# Altium project MCU_starter_25.PrjPcb
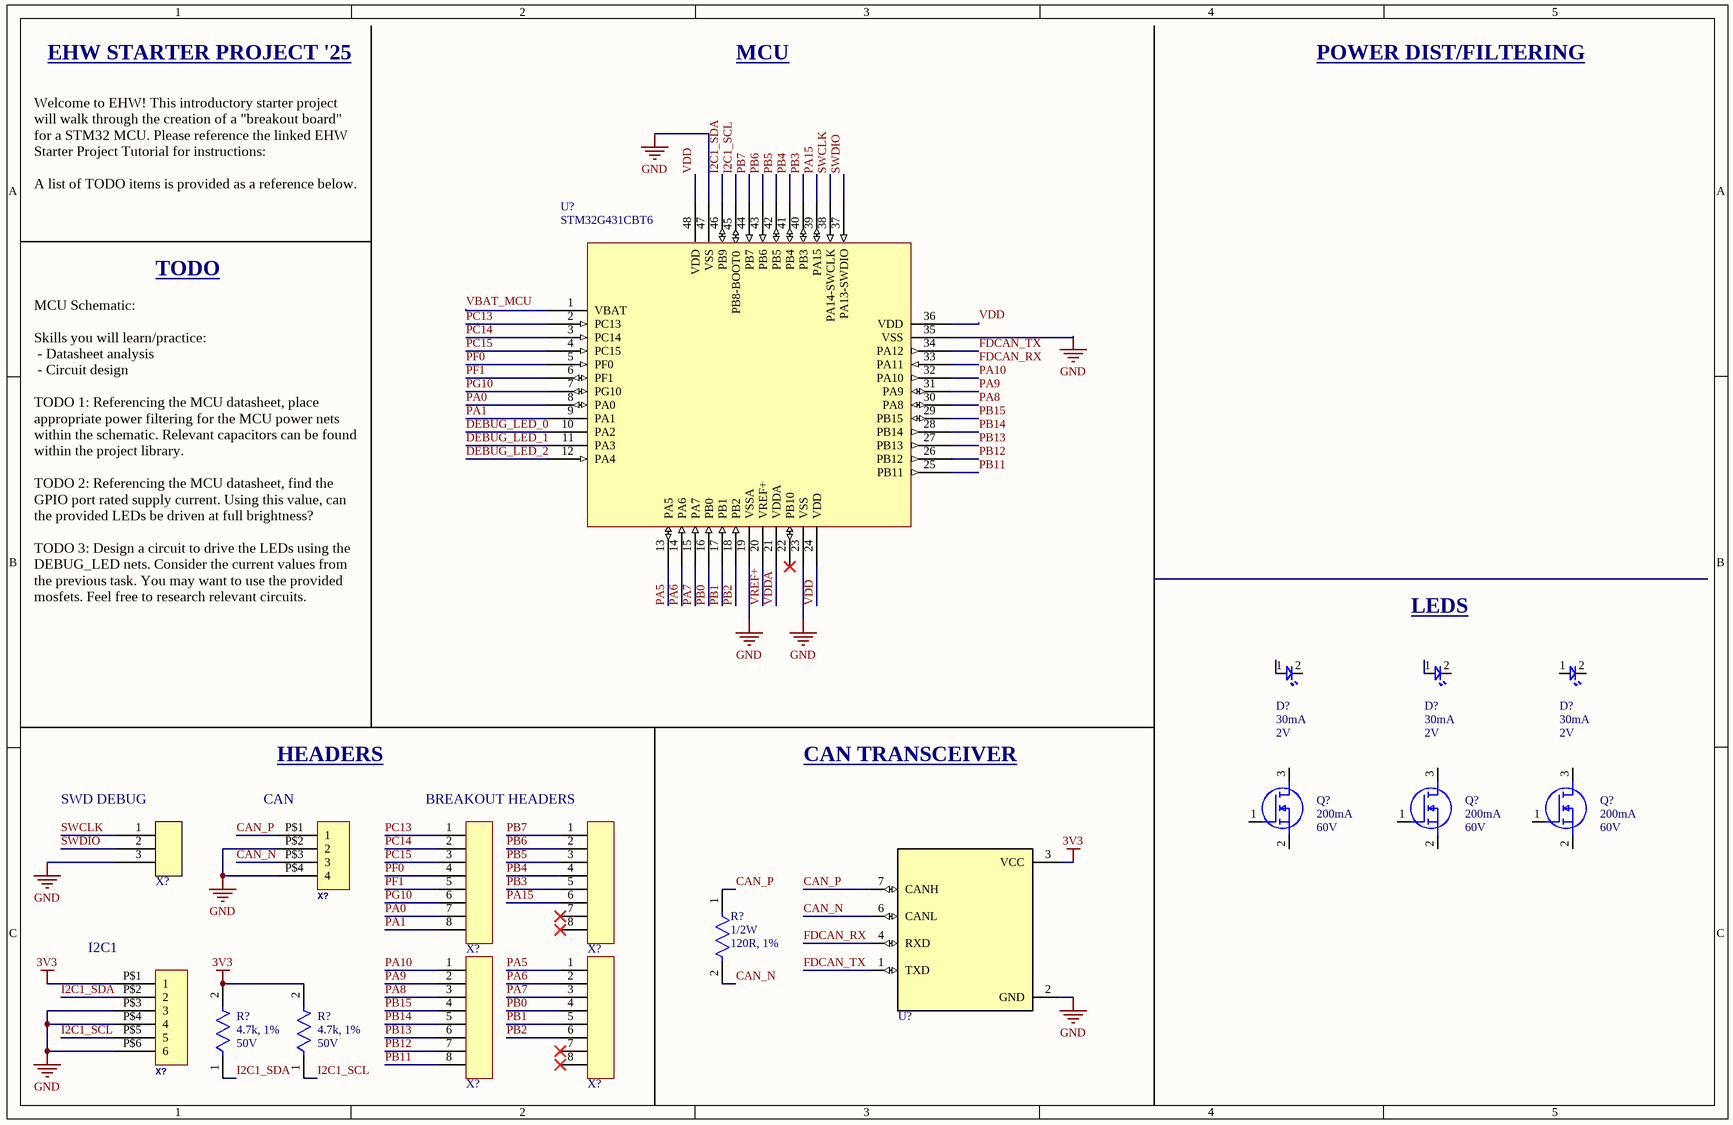
[diagram p0: MCU.SchDoc]
2 sheets, 32 parts. Net scope: global (net labels, ports and power ports of the same name join across sheets).
Sheets:
  MCU.SchDoc
  Power.SchDoc

## Sheet MCU.SchDoc
size 323 x 209 mm; SheetNumber: 1; SheetTotal: 2

### Parts
(Parts that share a designator on the sheet are numbered #1, #2 ... from top to bottom, then left to right.)
D?#1  Current Rating: 30mA  Vf: 2V  [LED0603-R-RD]  (hidden comment: BL-HKC36G-AV-TRB)
D?#2  Current Rating: 30mA  Vf: 2V  [LED0603-R-RD]  (hidden comment: BL-HKC36G-AV-TRB)
D?#3  Current Rating: 30mA  Vf: 2V  [LED0603-R-RD]  (hidden comment: BL-HKC36G-AV-TRB)
Q?#1  Id-Continuous: 200mA  VDS-Max: 60V  [NMOS-SOT23-3]  (hidden comment: T2N7002AK,LM)
Q?#2  Id-Continuous: 200mA  VDS-Max: 60V  [NMOS-SOT23-3]  (hidden comment: T2N7002AK,LM)
Q?#3  Id-Continuous: 200mA  VDS-Max: 60V  [NMOS-SOT23-3]  (hidden comment: T2N7002AK,LM)
R?#1  Power: 1/2W  Resistance: 120R, 1%  [RESC3126X60X50LL10T20]  (hidden comment: RC1210FR-07120RL)
R?#2  Voltage Rating: 50V  Resistance: 4.7k, 1%  [RESC1608X55X25LL10T15]  (hidden comment: RC0603FR-074K7L)
R?#3  Voltage Rating: 50V  Resistance: 4.7k, 1%  [RESC1608X55X25LL10T15]  (hidden comment: RC0603FR-074K7L)
U?#1  STM32G431CBT6  [Quad48]
U?#2  TCAN332GDR  [SOIC127P599X175-8N]  (value not drawn)
X?#1  61300811121  [61300811121]  (value not drawn)
X?#2  61300811121  [61300811121]  (value not drawn)
X?#3  Molex 43650-0415  [43650-0415]  (value not drawn)
X?#4  61300311121  [61300311121]  (value not drawn)
X?#5  61300811121  [61300811121]  (value not drawn)
X?#6  61300811121  [61300811121]  (value not drawn)
X?#7  Molex 43045-0612  [43045-0612]  (value not drawn)

### Nets
3V3: R?#2.2 R?#3.2 U?#2.3(VCC) X?#7.P$1(1)
GND: U?#1.19(VSSA) U?#1.23(VSS) U?#1.35(VSS) U?#1.47(VSS) U?#2.2(GND) X?#3.P$2(2) X?#3.P$4(4) X?#4.3 X?#7.P$3(3) X?#7.P$4(4) X?#7.P$6(6)
CAN_N: R?#1.2 U?#2.6(CANL) X?#3.P$3(3)
CAN_P: R?#1.1 U?#2.7(CANH) X?#3.P$1(1)
DEBUG_LED_0: U?#1.10(PA2)
DEBUG_LED_1: U?#1.11(PA3)
DEBUG_LED_2: U?#1.12(PA4)
FDCAN_RX: U?#1.33(PA11) U?#2.4(RXD)
FDCAN_TX: U?#1.34(PA12) U?#2.1(TXD)
I2C1_SCL: R?#3.1 U?#1.45(PB8-BOOT0) X?#7.P$5(5)
I2C1_SDA: R?#2.1 U?#1.46(PB9) X?#7.P$2(2)
PA0: U?#1.8(PA0) X?#1.7
PA1: U?#1.9(PA1) X?#1.8
PA5: U?#1.13(PA5) X?#6.1
PA6: U?#1.14(PA6) X?#6.2
PA7: U?#1.15(PA7) X?#6.3
PA8: U?#1.30(PA8) X?#5.3
PA9: U?#1.31(PA9) X?#5.2
PA10: U?#1.32(PA10) X?#5.1
PA15: U?#1.39(PA15) X?#2.6
PB0: U?#1.16(PB0) X?#6.4
PB1: U?#1.17(PB1) X?#6.5
PB2: U?#1.18(PB2) X?#6.6
PB3: U?#1.40(PB3) X?#2.5
PB4: U?#1.41(PB4) X?#2.4
PB5: U?#1.42(PB5) X?#2.3
PB6: U?#1.43(PB6) X?#2.2
PB7: U?#1.44(PB7) X?#2.1
PB11: U?#1.25(PB11) X?#5.8
PB12: U?#1.26(PB12) X?#5.7
PB13: U?#1.27(PB13) X?#5.6
PB14: U?#1.28(PB14) X?#5.5
PB15: U?#1.29(PB15) X?#5.4
PC13: U?#1.2(PC13) X?#1.1
PC14: U?#1.3(PC14) X?#1.2
PC15: U?#1.4(PC15) X?#1.3
PF0: U?#1.5(PF0) X?#1.4
PF1: U?#1.6(PF1) X?#1.5
PG10: U?#1.7(PG10) X?#1.6
SWCLK: U?#1.38(PA14-SWCLK) X?#4.1
SWDIO: U?#1.37(PA13-SWDIO) X?#4.2
VBAT_MCU: U?#1.1(VBAT)
VDD: U?#1.24(VDD) U?#1.36(VDD) U?#1.48(VDD)
VDDA: U?#1.21(VDDA)
VREF+: U?#1.20(VREF+)

Not connected (* = marked no-connect by the designer): D?#1 1 2; D?#2 1 2; D?#3 1 2; Q?#1 1(G) 2(S) 3(D); Q?#2 1(G) 2(S) 3(D); Q?#3 1(G) 2(S) 3(D); U?#1 22(PB10)*; X?#2 7* 8*; X?#6 7* 8*

### Notes on the sheet
- EHW STARTER PROJECT '25
- MCU
- POWER DIST/FILTERING
- Welcome to EHW! This introductory starter project will walk through the creation of a "breakout board" for a STM32 MCU. Please reference the linked EHW Starter Project Tutorial for instructions:
  A list of TODO items is provided as a reference below.
- TODO
- MCU Schematic:
  Skills you will learn/practice:
  - Datasheet analysis
  - Circuit design
  TODO 1: Referencing the MCU datasheet, place appropriate power filtering for the MCU power nets within the schematic. Relevant capacitors can be found within the project library.
  TODO 2: Referencing the MCU datasheet, find the GPIO port rated supply current. Using this value, can the provided LEDs be driven at full brightness?
  TODO 3: Design a circuit to drive the LEDs using the DEBUG_LED nets. Consider the current values from the previous task. You may want to use the provided mosfets. Feel free to research relevant circuits.
- LEDS
- (near X?#4) SWD DEBUG
- (near X?#3) CAN
- HEADERS
- (near X?#1) BREAKOUT HEADERS
- CAN TRANSCEIVER
- (near X?#7) I2C1

### Library data of the parts
D?#1-D?#3 = LED-0001: LED YELLOW CLEAR 0603 SMD
Q?#1-Q?#3 = NMOS-200MA-0001: MOSFET N-CH 60V 200MA SOT23; Manufacturer: Toshiba; FET type: N-Channel; Rds On-Max: 3.9Ohm; Vgs-Max: 20V; Assembled?: no; Manufacturer Part Number: T2N7002AK,LM; Package: SOT-23-3
R?#1 = RES-120-0001: 120 Ohms ±1% 0.5W, 1/2W Chip Resistor 1210 (3225 Metric) Moisture Resistant Thick Film; Manufacturer: Yageo; Part Number: RC1210FR-07120RL
R?#2 R?#3 = RES-4.7k-0001: Chip Resistor, 4.7 KOhm, +/- 1%, 0.1 W, -55 to 155 degC, 0603 (1608 Metric), RoHS, Tape and Reel; Manufacturer: Yageo; Power Rating: 100mW; Temperature Coefficient: 100PPM/C; Package Reference: 0603; Series: RC; Datasheet Version: Rev. 7, 05/2017; Packaging: Reel; Termination Style: SMD/SMT; Datasheet URL: http://www.yageo.com/documents/recent/PYu-RC_Group_51_RoHS_L_7.pdf; Manufacturer URL: http://www.yageo.com/; Package Description: 2-Pin Surface Mount Device, Body 1.6 x 0.8 mm; Case Code - mm: 1608; Case Code - in: 0603; Mounting Technology: SurfaceMount; Operating Temperature Range: -55Cto+155C; Tolerance: 1%; Product: ThickFilmResistorsGeneralPurpose
U?#1 = IC-STM32G431CBT6: ARM® Cortex®-M4F STM32G4 Microcontroller IC 32-Bit Single-Core 170MHz 128KB (128K x 8) FLASH 48-LQFP (7x7); Parameter 1: *
U?#2 = IC-CAN-0001: 3.3-V CAN Transceivers with CAN FD (Flexible Data Rate); MF: Texas Instruments; Purchase-URL: https://pricing.snapeda.com/search?q=TCAN332GDR&ref=eda; Package: SOIC-8 Texas Instruments; Check_prices: https://www.snapeda.com/parts/TCAN332GDR/Texas+Instruments/view-part/?ref=eda; Value: *; SnapEDA_Link: https://www.snapeda.com/parts/TCAN332GDR/Texas+Instruments/view-part/?ref=snap; MP: TCAN332GDR; Digi-Key_Part_Number: 296-48678-2-ND
X?#1 X?#2 X?#5 X?#6 = CONN-8POS-0001: CONN HEADER VERT 8POS 2.54MM; NexarPartId: 32855533; Connector Type: Male Pin; Number of Contacts: 8; Voltage Rating: 250V; Current Rating: 3A; Contact Resistance: 20mΩ; Gender: Male; Termination: Solder; Contact Material: Copper; Mount: Through Hole; Lead Pitch: 2.54mm; Number of Positions: 8; Operating Supply Voltage: 250V; Number of Pins: 8; Max Operating Temperature: 105°C; Height: 8.54mm; Pitch: 2.54mm; REACH SVHC: Unknown; Number of Rows: 1; Packaging: Bulk; Contact Plating: Gold; Contact Mating Length: 5.9944mm; Orientation: Vertical; RoHS: Compliant; Color: Black; Min Operating Temperature: -40°C
X?#3 = CONN-4POS-0001: GateName_1: G$1; SymbolName_1: HEADER_POS4; DeviceSetName: HEADER_POS4_?; DeviceName: 43650-0415; LibraryName: con-molex-micro-fit-3_0_2; Package: 43650-0415
X?#4 = CONN-3POS-0001: Connector Header Through Hole 3 position 0.100" (2.54mm); NexarPartId: 32855521; Current Rating: 3A; Voltage Rating: 250V; Number of Positions: 3; Contact Resistance: 20mΩ; Connector Type: Male Pin; Gender: Male; REACH SVHC: Unknown; Packaging: Bulk; Contact Material: Copper; Pitch: 2.54mm; Min Operating Temperature: -40°C; Number of Rows: 1; Orientation: Vertical; RoHS: Compliant; Contact Plating: Gold; Max Operating Temperature: 105°C; Mount: Through Hole; Height: 8.94mm; Operating Supply Voltage: 250V; Number of Pins: 3; Contact Mating Length: 5.9944mm; Number of Contacts: 3; Color: Black; Lead Free: Lead Free; Lead Pitch: 2.54mm; Termination: Solder
X?#7 = CONN-6POS-0001: GateName_1: G$1; SymbolName_1: HEADER_POS6; DeviceSetName: HEADER_POS6_?; DeviceName: 43045-0612; LibraryName: con-molex-micro-fit-3_0_2; Package: 43045-0612

## Sheet Power.SchDoc
size 259 x 167 mm; SheetNumber: 2; SheetTotal: 2
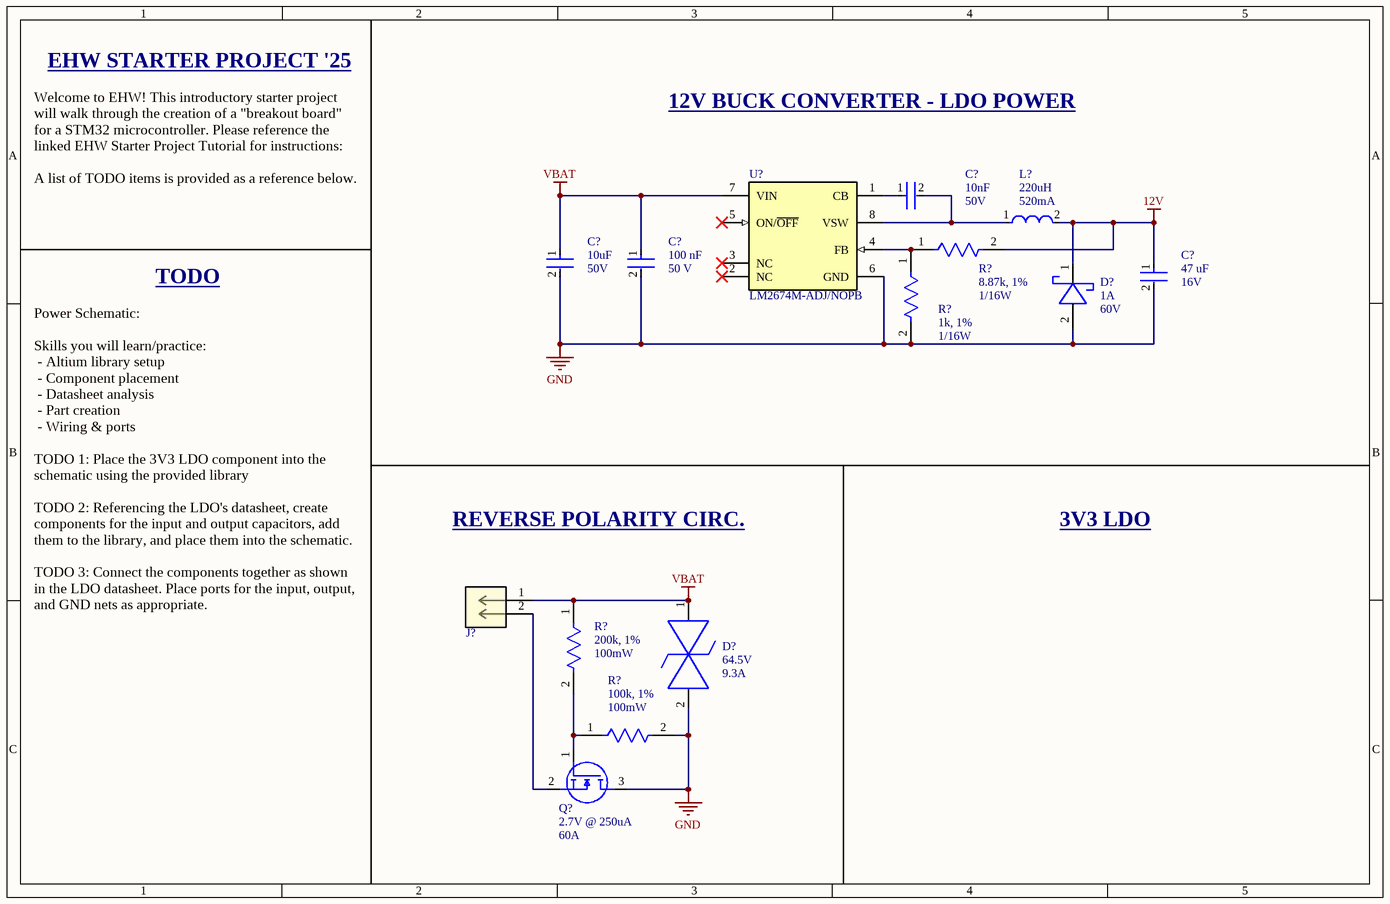
[diagram p1: Power.SchDoc]

### Parts
(Parts that share a designator on the sheet are numbered #1, #2 ... from top to bottom, then left to right.)
C?#1  Voltage Rating (DC): 50V  Capacitance: 10nF  [FP-GRM219-0_1-MFG]  (hidden comment: GRM2195C1H103JA01D)
C?#2  Voltage Rating (DC): 50V  Capacitance: 10uF  [FP-CL32-IPC_B]  (hidden comment: CL32B106KBJNNNE)
C?#3  Voltage Rating: 50 V  Capacitance: 100 nF  [FP-CC0805-0_85-MFG]  (hidden comment: CC0805KRX7R9BB104)
C?#4  Capacitance: 47 uF  Voltage: 16V  [FP-GRM32E-0_3-0_2-MFG]  (hidden comment: GRM32ER61C476KE15L)
D?#4  Forward Current: 1A  Reverse Voltage (DC): 60V  [SDO_SOD123F_NEX]  (hidden comment: PMEG6010CEH,115)
D?#5  Clamping Voltage: 64.5V  Current: 9.3A  [SMB]  (hidden comment: SMBJ40CA)
J?  Molex 0436500215  [CON_436500215_MOL]  (value not drawn)
L?  Inductance: 220uH  Current Rating: 520mA  [IND-220UH-0001]  (hidden comment: CDRH104NP-221MC)
Q?#4  Vgs: 2.7V @ 250uA  Drain Current: 60A  [FP-DNH0008A-MFG]  (hidden comment: CSD18543Q3AT)
R?#4  Power: 1/16W  Resistance: 1k, 1%  [RESC1005X40X25NL05T10]  (hidden comment: RC0402FR-071KL)
R?#5  Resistance: 8.87k, 1%  Power: 1/16W  [RESC1005X40X25NL05T10]  (hidden comment: RC0402FR-078K87L)
R?#6  Power: 100mW  Resistance: 200k, 1%  [FP-RC0603-0_55-IPC_B]  (hidden comment: RC0603FR-07200KL)
R?#7  Power: 100mW  Resistance: 100k, 1%  [FP-RC0603-0_55-IPC_B]  (hidden comment: RC0603FR-07100KL)
U?#3  LM2674M-ADJ/NOPB  [D0008A_N]

### Nets
12V: C?#4.1 D?#4.1(ANODE) L?.2 R?#5.2
GND: C?#2.2 C?#3.2 C?#4.2 D?#4.2(CATHODE) D?#5.2 Q?#4.3(D) R?#4.2 R?#7.2 U?#3.6(GND)
VBAT: C?#2.1 C?#3.1 D?#5.1 J?.1 R?#6.1 U?#3.7(VIN)
NetC?#1_1: C?#1.1 U?#3.1(CB)
NetC?#1_2: C?#1.2 L?.1 U?#3.8(VSW)
NetJ?_2: J?.2 Q?#4.2(S)
NetQ?#4_1: Q?#4.1(G) R?#6.2 R?#7.1
NetR?#4_1: R?#4.1 R?#5.1 U?#3.4(FB)

Not connected (* = marked no-connect by the designer): U?#3 2(NC)* 3(NC)* 5(ON/~{OFF})*

### Notes on the sheet
- EHW STARTER PROJECT '25
- 12V BUCK CONVERTER - LDO POWER
- Welcome to EHW! This introductory starter project will walk through the creation of a "breakout board" for a STM32 microcontroller. Please reference the linked EHW Starter Project Tutorial for instructions:
  A list of TODO items is provided as a reference below.
- TODO
- REVERSE POLARITY CIRC.
- 3V3 LDO
- Power Schematic:
  Skills you will learn/practice:
  - Altium library setup
  - Component placement
  - Datasheet analysis
  - Part creation
  - Wiring & ports
  TODO 1: Place the 3V3 LDO component into the schematic using the provided library
  TODO 2: Referencing the LDO's datasheet, create components for the input and output capacitors, add them to the library, and place them into the schematic.
  TODO 3: Connect the components together as shown in the LDO datasheet. Place ports for the input, output, and GND nets as appropriate.

### Library data of the parts
C?#1 = CAP-10N-0001: CAP CER 10000PF 50V C0G/NP0 0805; Dielectric Material: Ceramic; Dielectric: C0G; Insulation Resistance: 10GR; Tolerance: 5%; Temperature Coefficient: 30ppm/°C; Max Operating Temperature: 125°C; Height: 0.85mm; Voltage: 50V; Voltage Rating: 50V; Thickness: 0.037inch; REACH SVHC: No SVHC; Lead Free: Lead Free; Depth: 1.25mm; Min Operating Temperature: -55°C; Package Quantity: 1; Packaging: Tape and Reel; Case Code (Imperial): 0805; Case/Package: 0805; Mount: Surface Mount; Width: 0.049inch; Case Code (Metric): 2012; Length: 2mm; Termination: SMD/SMT; Material: Ceramic; Number of Pins: 2; Radiation Hardening: No
C?#2 = CAP-10U-0002: CAP CER 10UF 50V X7R 1210; Tolerance: 10%; Material: Ceramic; Min Operating Temperature: -55°C; Depth: 2.5mm; Radiation Hardening: No; Packaging: Tape and Reel; Dielectric: X7R; Case Code (Metric): 3225; Height: 2.5mm; Thickness: 0.106inch; Voltage Rating: 50V; Width: 0.098inch; Case Code (Imperial): 1210; Length: 3.2mm; Lead Free: Lead Free; Package Quantity: 1; Voltage: 50V; Mount: Surface Mount; Case/Package: 1210; Max Operating Temperature: 125°C
C?#3 = CAP-0.1U-0002: CAP CER 0.1UF 50V X7R 0805; Manufacturer: Yageo; Tolerance: 0.1; Value: 100 nF; Material: Ceramic; Device Class L1: Passive Components; ComponentLink2Description: Datasheet; Package: CC0805-0.85; Manufacturer Part Number: CC0805KRX7R9BB104; Digikey Description: CAP CER 0.1UF 50V X7R 0805; Device Class L3: Ceramic Capacitors; Temperature: -30°C to +85°C; Temperature Characteristic: X7R; Height: 0.95mm; RoHS: TRUE; Ipc Land Pattern Name: CAPC200125X85; Device Class L2: Capacitors; Category: Cap; Temperature Range Low: -30°C; Temperature Range High: +85°C; Mouser Description: Multilayer Ceramic Capacitors MLCC - SMD/SMT 100nF 50V X7R 10%; Footprint Url: http://www.yageo.com/exep/pages/download/literatures/UPY-C_GEN_24.pdf; Automotive: No; Octopart: https://octopart.com/cc0805krx7r9bb104-yageo-192993; Lead Free: Yes; ComponentLink2URL: http://www.yageo.com/documents/recent/UPY-GPHC_Y5V_6.3V-to-50V_8.pdf
C?#4 = CAP-47U-0002: CAP CER 47UF 16V X5R 1210; Tolerance: 10%; Material: Ceramic; RoHS Compliant: Yes; Min Operating Temperature: -55°C; Radiation Hardening: No; Package Quantity: 1; Case Code (Imperial): 1210; REACH SVHC: No SVHC; Voltage Rating (DC): 16V; Dielectric: X5R; Case/Package: 1210; Length: 3.2mm; Voltage Rating: 16V; Packaging: Cut Tape; Width: 0.098inch; Number of Pins: 2; Lead Free: Lead Free; Height: 2.5mm; Mount: Surface Mount; Termination: SMD/SMT; Max Operating Temperature: 85°C; Thickness: 0.106inch; Depth: 2.5mm; Case Code (Metric): 3225
D?#4 = DIO-SHOTTKY-0002: Diode 60 V 1A Surface Mount SOD-123F; Mfr_Name: Nexperia
D?#5 = DIO-TVS-0001: TVS DIODE 40VWM 64.5VC DO214AA; Mfr_Name: Bourns Electronics
J? = CONN-BATT-0001: Connector Header Through Hole 2 position 0.118" (3.00mm); Mfr_Name: Molex Connector Corporation; RefDes: RefDes; Type: Type
L? = IND-220U-0001: FIXED IND 220UH 520MA 960MOHM SM
Q?#4 = NMOS-60A-0001: MOSFET N-CH 60V 12A/60A 8VSON; pin to pad: 1-3>1+2+3 5-8>5-6-7-8; Manufacturer: Texas Instruments; Turn On Delay Time: 9ns; Number Of Channels: 1; Reverse Recovery Charge: 37nC; Continuous Drain Current: 12A; Pulse Drain Current: 156A; Typ Forward Diode Voltage: 0.8V; Gate Charge At Vgs: 11.1nC @ 10V; Depletion Mode: False; Transconductance: 40S; Threshold Vgs Min: 1.5V; Max Forward Diode Voltage: 1V; Turn Off Delay Time: 8ns; Threshold Vgs Max: 2.7V; Power Dissipation: 2.8W; Max Junction Temp: +150°C; Reverse Recovery Time: 27ns; Drain To Source Resistance: 8.1mΩ; Standoff Height: 0mm; Rthja Max: 55°C/W; Input Capacitace At Vds: 885pF @ 30V; Gate To Source Voltage: 20V; Device Class L1: Discrete Semiconductors; ComponentLink2Description: Datasheet; Drain To Source Voltage: 60V; Mouser Description: Transistor: N-MOSFET; unipolar; 60V; 35A; 66W; VSONP8 3, 3x3, 3mm; RoHS: TRUE; Manufacturer Part Number: CSD18543Q3AT; Digikey Description: 60V N-CHANNEL NEXFET POWER MOSF; Lead Free: Yes; Height: 0.9mm; Device Class L3: MOSFETs; Number Of N Channels: 1; Drain To Source Breakdown Voltage: 60V; Category: Trans; Automotive: No; Package: DNH0008A; Octopart: https://octopart.com/csd18543q3at-texas+instruments-77040189; Temperature Range Low: -55°C; Device Class L2: Transistors; Temperature: -55°C to +150°C; Temperature Range High: +150°C; ComponentLink2URL: http://www.ti.com/lit/ds/symlink/csd18543q3a.pdf
R?#4 = RES-1k-0001: RES 1K OHM 1% 1/16W 0402; Max Power Dissipation: 63mW; Voltage Rating (DC): 50V; Temperature Coefficient: 100ppm/°C; Power Rating: 62.5mW; Technology: THICK FILM; Size Code: 0402; Series: RC; Length: 1mm; Case/Package: 0402; Features: Moisture Resistant; Termination: SMD/SMT; Case Code (Metric): 1005; Reach SVHC Compliant: Yes; Number of Terminations: 2; Tolerance: 1%; Lead Free: Lead Free; Military Standard: Not; Resistor Type: Thick Film; Max Operating Temperature: 155°C; RoHS Compliant: Yes; Construction: Rectangular; Voltage Rating: 50V; Packaging: Tape and Reel; Height: 0.32mm; Number of Pins: 2; Resistance Tolerance: 1%; Case Code (Imperial): 0402; Depth: 0.5mm; Min Operating Temperature: -55°C; Width: 0.5mm
R?#5 = RES-8.87k-0001: RES 8.87K OHM 1% 1/16W 0402; Manufacturer: Yageo / Phycomp; Part Number: RC0402FR-078K87L
R?#6 = RES-200k-0001: RES SMD 200K OHM 1% 1/10W 0603; Temperature Coefficient: 100ppm/°C; Voltage Rating: 50V; Packaging: Tape and Reel; REACH SVHC: No SVHC; Resistance Tolerance: 1%; Number of Pins: 2; Width: 0.031inch; Termination: SMD/SMT; Features: Moisture Resistant; Tolerance: 1%; Series: RC; Case Code (Imperial): 0603; Depth: 0.8mm; Number of Terminations: 2; Max Operating Temperature: 155°C; Resistor Type: Thick Film; Height: 0.022inch; Lead Free: Lead Free; Construction: Rectangular; Case/Package: 0603; Max Power Dissipation: 100mW; Power Rating: 100mW; Case Code (Metric): 1608; Length: 1.6mm; Size Code: 0603; RoHS Compliant: Yes; Military Standard: Not; Min Operating Temperature: -55°C; Package Quantity: 1; Voltage Rating (DC): 50V
R?#7 = RES-100k-0001: RES SMD 100K OHM 1% 1/10W 0603; Voltage Rating (DC): 50V; Temperature Coefficient: 100ppm/°C; Working Voltage: 75V; Length: 1.6mm; Lead Free: Lead Free; Number of Terminations: 2; Packaging: Tape and Reel; Voltage Rating: 50V; Termination: SMD/SMT; Width: 0.8mm; Resistor Type: Thick Film; Max Power Dissipation: 100mW; Resistance Tolerance: 1%; Features: Moisture Resistant; Height: 0.45mm; Construction: Rectangular; Case/Package: 0603; Military Standard: Not; Case Code (Imperial): 0603; Series: RC; Technology: THICK FILM; Depth: 0.8mm; RoHS Compliant: Yes; REACH SVHC: No SVHC; Min Operating Temperature: -55°C; Case Code (Metric): 1608; Max Operating Temperature: 155°C; Power Rating: 100mW; Number of Pins: 2; Tolerance: 1%
U?#3 = IC-BUCK-0002: IC REG BUCK ADJ 500MA 8SOIC; Manufacturer: Texas Instruments; PackageTopMarking: NSZXTT*2674*MADJ; CompType: Switcher; PowerWise: N; ComponentLink1Description: Datasheet URL; PinCount: 8; RoHS: Y; ComponentLink1URL: http://www.ti.com/general/docs/lit/getliterature.tsp?genericPartNumber=LM2674&fileType=pdf; Code_IPC: SOIC127P600-8; PackageReference: D0008A; PackageDescription: SOIC Narrow, 4.9 x 3.9 x 1.45mm, 8 Lead, 1.27mm Pitch; Code_JEDEC: MS-012-AA

## Nets that join several sheets
GND: MCU (11 pins), Power (9 pins)